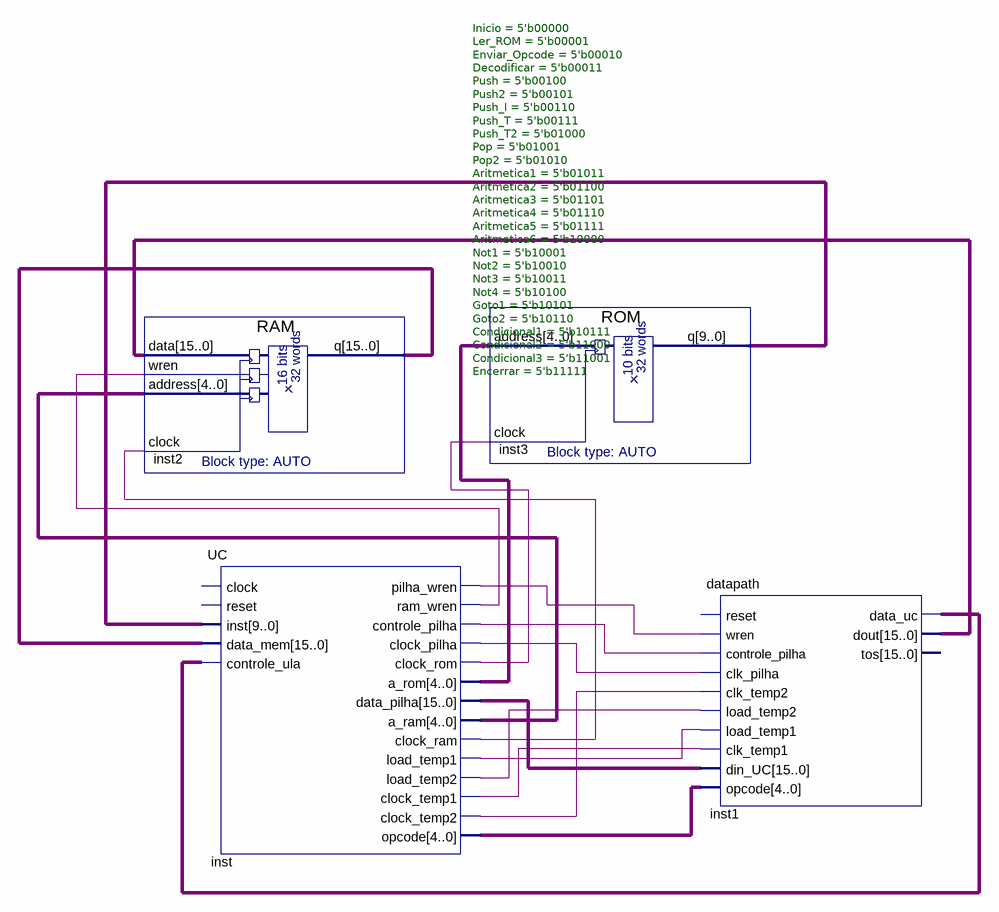
[diagram p0: schematic sheet]
// Quartus schematic processador.bdf as structural Verilog: 4 symbols, 0 pins
module processador (
);

  wire inst1_data_uc, inst_clock_pilha, inst_clock_ram, inst_clock_rom, inst_clock_temp1, inst_clock_temp2,
       inst_controle_pilha, inst_load_temp1, inst_load_temp2, inst_pilha_wren, inst_ram_wren;
  wire [4:0] inst_a_ram, inst_a_rom, inst_opcode;
  wire [9:0] inst3_q;
  wire [15:0] inst1_dout, inst2_q, inst_data_pilha;

  RAM inst2 (.data(inst1_dout), .wren(inst_ram_wren), .address(inst_a_ram), .clock(inst_clock_ram), .q(inst2_q));
  UC #(.Inicio(5'b00000), .Ler_ROM(5'b00001), .Enviar_Opcode(5'b00010), .Decodificar(5'b00011), .Push(5'b00100), .Push2(5'b00101), .Push_I(5'b00110), .Push_T(5'b00111), .Push_T2(5'b01000), .Pop(5'b01001), .Pop2(5'b01010), .Aritmetica1(5'b01011), .Aritmetica2(5'b01100), .Aritmetica3(5'b01101), .Aritmetica4(5'b01110), .Aritmetica5(5'b01111), .Aritmetica6(5'b10000), .Not1(5'b10001), .Not2(5'b10010), .Not3(5'b10011), .Not4(5'b10100), .Goto1(5'b10101), .Goto2(5'b10110), .Condicional1(5'b10111), .Condicional2(5'b11000), .Condicional3(5'b11001), .Encerrar(5'b11111)) inst (
    .inst(inst3_q), .data_mem(inst2_q), .controle_ula(inst1_data_uc), .pilha_wren(inst_pilha_wren),
    .ram_wren(inst_ram_wren), .controle_pilha(inst_controle_pilha), .clock_pilha(inst_clock_pilha),
    .clock_rom(inst_clock_rom), .a_rom(inst_a_rom), .data_pilha(inst_data_pilha), .a_ram(inst_a_ram),
    .clock_ram(inst_clock_ram), .load_temp1(inst_load_temp1), .load_temp2(inst_load_temp2),
    .clock_temp1(inst_clock_temp1), .clock_temp2(inst_clock_temp2), .opcode(inst_opcode));  // open: clock, reset
  ROM inst3 (.address(inst_a_rom), .clock(inst_clock_rom), .q(inst3_q));
  datapath inst1 (
    .wren(inst_pilha_wren), .controle_pilha(inst_controle_pilha), .clk_pilha(inst_clock_pilha),
    .clk_temp2(inst_clock_temp2), .load_temp2(inst_load_temp2), .load_temp1(inst_load_temp1),
    .clk_temp1(inst_clock_temp1), .din_UC(inst_data_pilha), .opcode(inst_opcode), .data_uc(inst1_data_uc),
    .dout(inst1_dout));  // open: reset, tos
endmodule
